# EAGLE design FT232R-Breakout-v36-0805 (EAGLE 6.1)
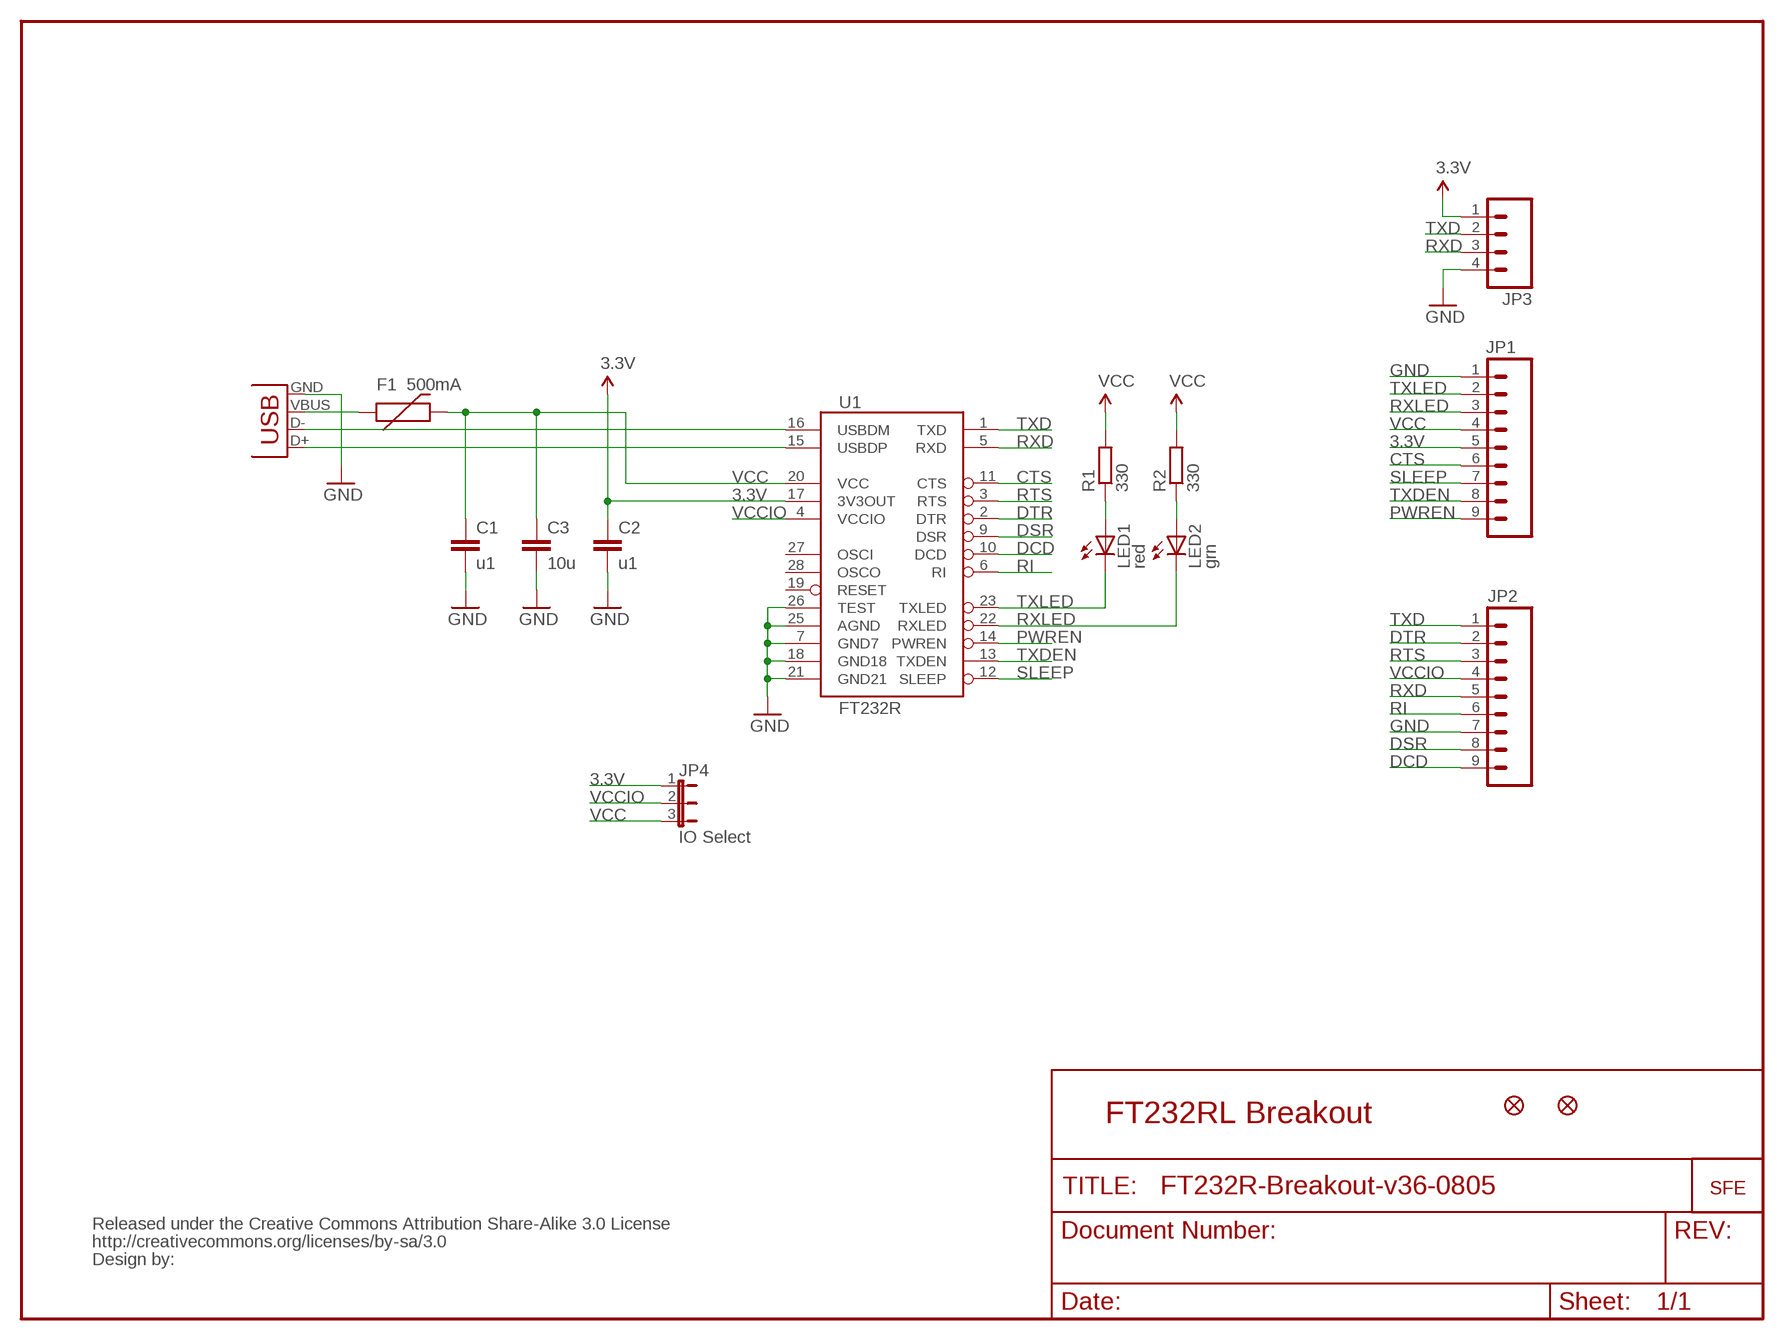
[diagram p0: schematic, sheet 1]

## Parts
C1  u1  C-EUC0805K  [C0805K]
C2  u1  C-EUC0805K  [C0805K]
C3  10u  C-EUC0805K  [C0805K]
F1  500mA  PTC0603  [0603]
JP1  M09  [1X09]
JP2  M09  [1X09]
JP3  M04PTH  [1X04]
JP4  IO Select  JUMPER-3SMD  [SJ_3]
JP5  FIDUCIAL1X2  [FIDUCIAL-1X2]
JP6  FIDUCIAL1X2  [FIDUCIAL-1X2]
LED1  red  LEDCHIP-LED0805  [CHIP-LED0805]
LED2  grn  LEDCHIP-LED0805  [CHIP-LED0805]
R1  330  R-EU_M0805  [M0805]
R2  330  R-EU_M0805  [M0805]
U1  FT232R  FT232RLSSOP  [SSOP28DB]
U$1  CREATIVE_COMMONS  [CREATIVE_COMMONS]
U$2  LOGO-SFENEW  [SFE-NEW-WEBLOGO]
X2  USBSMD  [USB-MINIB]

## Nets
3.3V [power]: C2.1 JP1.5 JP3.1 JP4.1 U1.17(3V3OUT)
CTS: JP1.6 U1.11(CTS)
DCD: JP2.9 U1.10(DCD)
DSR: JP2.8 U1.9(DSR)
DTR: JP2.2 U1.2(DTR)
GND [power]: C1.2 C2.2 C3.2 JP1.1 JP2.7 JP3.4 U1.7(GND7) U1.18(GND18) U1.21(GND21) U1.25(AGND) U1.26(TEST) X2.GND
N$1: LED1.A R1.1
N$2: LED2.A R2.1
N$3: F1.1 X2.VBUS
PWREN: JP1.9 U1.14(PWREN)
RI: JP2.6 U1.6(RI)
RTS: JP2.3 U1.3(RTS)
RXD: JP2.5 JP3.3 U1.5(RXD)
RXLED: JP1.3 LED2.C U1.22(RXLED)
SLEEP: JP1.7 U1.12(SLEEP)
TXD: JP2.1 JP3.2 U1.1(TXD)
TXDEN: JP1.8 U1.13(TXDEN)
TXLED: JP1.2 LED1.C U1.23(TXLED)
USB_D+: U1.15(USBDP) X2.D+
USB_D-: U1.16(USBDM) X2.D-
VCC [power]: C1.1 C3.1 F1.2 JP1.4 JP4.3 R1.2 R2.2 U1.20(VCC)
VCCIO: JP2.4 JP4.2 U1.4(VCCIO)
Unconnected: U1.19(RESET) U1.27(OSCI) U1.28(OSCO)

## Notes on the sheet
- FT232RL Breakout

## Library data of the parts
C1-C3 = rcl:C-EU: CAPACITOR, European symbol
F1 = SparkFun:PTC: Resettable Fuse PTC Resettable Fuse. Spark Fun Electronics SKU : COM-08357
JP1 JP2 = SparkFun:M09: Header 9 Standard 9-pin 0.1" header. Use with straight break away headers (SKU : PRT-00116), right angle break away headers (PRT-00553), swiss pins (PRT-00743), machine pins (PRT-00117), and female headers (PRT-00115).
JP3 = SparkFun:M04: Header 4 Standard 4-pin 0.1" header. Use with straight break away headers (SKU : PRT-00116), right angle break away headers (PRT-00553), swiss pins (PRT-00743), machine pins (PRT-00117), and female headers (PRT-00115). Molex polarized connector foot print use with SKU : PRT-08231 with associated crimp pins and housings.
JP4 = SparkFun:JUMPER-3
JP5 JP6 = SparkFun:FIDUCIAL: Fiducial Alignment Points Various fiducial points for machine vision alignment.
LED1 LED2 = led:LED: LED OSRAM: - CHIPLED LG R971, LG N971, LY N971, LG Q971, LY Q971, LO R971, LY R971 LH N974, LH R974 LS Q976, LO Q976, LY Q976 LO Q996 - Hyper CHIPLED LW Q18S LB Q993, LB Q99A, LB R99A - SideLED LS A670, LO A670, LY A670, LG A670, LP A670 LB A673, LV A673, LT A673, LW A673 LH A674 LY A675 LS A676, LA A676, LO A676, LY A676, LW A676 LS A679, LY A679, LG A679 - Hyper Micro SIDELED® LS Y876, LA Y876, LO Y876, LY Y876 LT Y87S - SmartLED LW L88C, LW L88S LB L89C, LB L89S, LG L890 LS L89K, LO L89K, LY L89K LS L896, LA L896, LO L896, LY L896 - TOPLED LS T670, LO T670, LY T670, LG T670, LP T670 LSG T670, LSP T670, LSY T670, LOP T670, LYG T670 LG T671, LOG T671, LSG T671 LB T673, LV T673, LT T673, LW T673 LH T674 LS T676, LA T676, LO T676, LY T676, LB T676, LH T676, LSB T676, LW T676 LB T67C, LV T67C, LT T67C, LS T67K, LO T67K, LY T67K, LW E67C LS E67B, LA E67B, LO E67B, LY E67B, LB E67C, LV E67C, LT E67C LW T67C LS T679, LY T679, LG T679 LS T770, LO T770, LY T770, LG T770, LP T770 LB T773, LV T773, LT T773, LW T773 LH T774 LS E675, LA E675, LY E675, LS T675 LS T776, LA T776, LO T776, LY T776, LB T776 LHGB T686 LT T68C, LB T68C - Hyper Mini TOPLED® LB M676 - Mini TOPLED Santana® LG M470 LS M47K, LO M47K, LY M47K Source: http://www.osram.convergy.de LUXEON: - LUMILED® LXK2-PW12-R00, LXK2-PW12-S00, LXK2-PW14-U00, LXK2-PW14-V00 LXK2-PM12-R00, LXK2-PM12-S00, LXK2-PM14-U00 LXK2-PE12-Q00, LXK2-PE12-R00, LXK2-PE12-S00, LXK2-PE14-T00, LXK2-PE14-U00 LXK2-PB12-K00, LXK2-PB12-L00, LXK2-PB12-M00, LXK2-PB14-N00, LXK2-PB14-P00, LXK2-PB14-Q00 LXK2-PR12-L00, LXK2-PR12-M00, LXK2-PR14-Q00, LXK2-PR14-R00 LXK2-PD12-Q00, LXK2-PD12-R00, LXK2-PD12-S00 LXK2-PH12-R00, LXK2-PH12-S00 LXK2-PL12-P00, LXK2-PL12-Q00, LXK2-PL12-R00 Source: www.luxeon.com KINGBRIGHT: KA-3528ASYC Source: www.kingbright.com
R1 R2 = rcl:R-EU_: RESISTOR, European symbol
U1 = SparkFun:FT232RL: USB UART FT232RL 4th Generation USB UART (USB <-> Serial) Controller. Spark Fun Electronics SKU : COM-00650
U$1 = SparkFun:CREATIVE_COMMONS
U$2 = SparkFun:LOGO-SFE: Spark Fun Electronics PCB Logo This is the standard Spark Fun Electronics PCB logo.
X2 = SparkFun:USB: USB Connectors USB-B-PTH is fully proven SKU : PRT-00139 USB-miniB is fully proven SKU : PRT-00587 USB-A-PCB is untested. USB-A-H is throughly reviewed, but untested. Spark Fun Electronics SKU : PRT-00437 USB-B-SMT is throughly reviewed, but untested. Needs silkscreen touching up. USB-A-S has not been used/tested USB-MB-H has not been used/tested

## Net classes
0 default: width 0.203 mm
1 power: width 0.254 mm

## Board
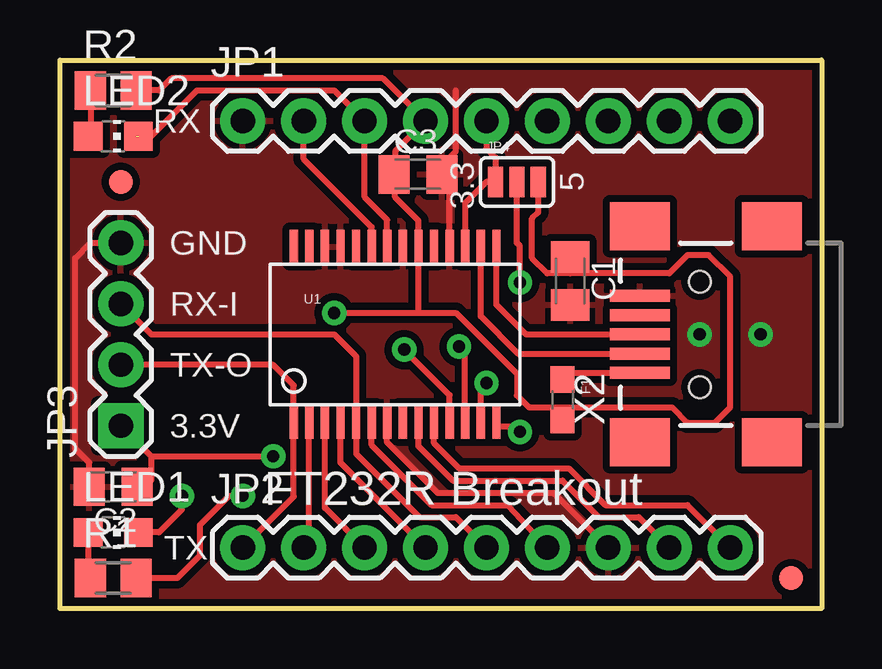
[diagram p1: board, top side]
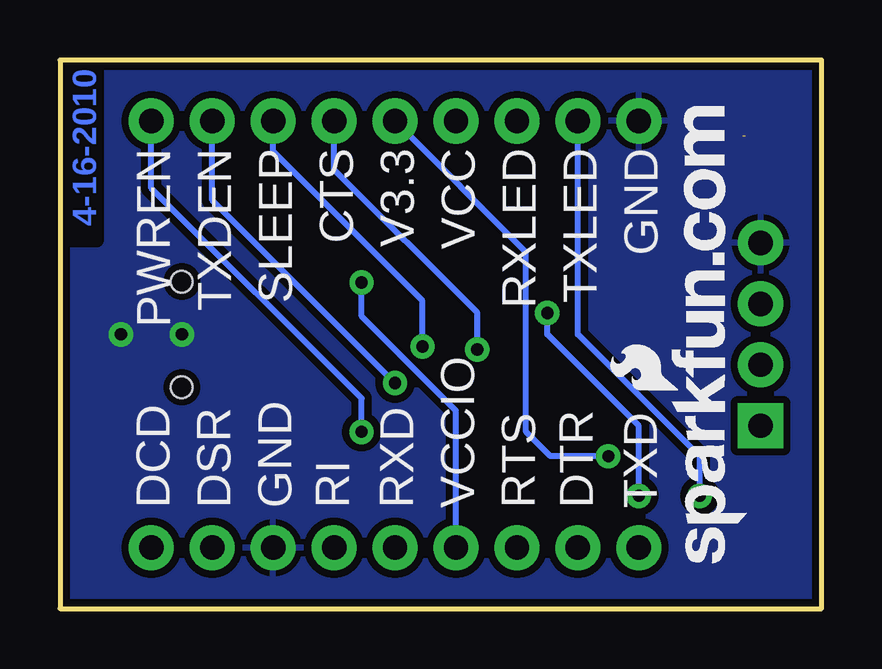
[diagram p2: board, bottom side, seen from below]

Size 31.75 x 22.86 mm. Coordinates in mm from the lower left corner, seen from the top.
Outline: 0,22.86 31.75,22.86 31.75,0 0,0 0,22.86
Copper layers (1*16): Top 0.035mm / dielectric 1.5mm / Bottom 0.035mm
Design rules: minimum track width 8mil, minimum drill 20mil, track to track 8mil, track to pad 8mil, pad to pad 8mil, via to via 8mil, smd to smd 8mil, copper to edge 10mil, drill to drill 8mil, minimum pad ring 12mil, minimum via ring 10mil, stop-mask expansion 4mil, vias tented up to drill 20mil, thermal gap 10mil

### Footprints (pad centres in the part's own frame; a part is rotated, then mirrored left to right if it is on the bottom)
C0805K = smd 1.3 x 1.6: 1 -1,0; 2 1,0
0603 = smd 1.1 x 1: 1 -0.85,0; 2 0.85,0
1X09 = drill 1.016 pad 1.88: 1 0,0; 2 2.54,0; 3 5.08,0; 4 7.62,0; 5 10.16,0; 6 12.7,0; 7 15.24,0; 8 17.78,0; 9 20.32,0
1X04 = drill 1.016 pad 1.88 square: 1 0,0 | drill 1.016 pad 1.88: 2 2.54,0; 3 5.08,0; 4 7.62,0
SJ_3 = smd 0.635 x 1.27: 1 -0.889,0; 2 0,0; 3 0.889,0
FIDUCIAL-1X2 = smd 1 x 1: 1 0,0
CHIP-LED0805 = smd 1.2 x 1.2: A 0,-1.05; C 0,1.05
M0805 = smd 1.3 x 1.6: 1 -0.95,0; 2 0.95,0
SSOP28DB = smd 0.348 x 1.397: 1 -4.225,-3.656; 2 -3.575,-3.656; 3 -2.925,-3.656; 4 -2.275,-3.656; 5 -1.625,-3.656; 6 -0.975,-3.656; 7 -0.325,-3.656; 8 0.325,-3.656; 9 0.975,-3.656; 10 1.625,-3.656; 11 2.275,-3.656; 12 2.925,-3.656; 13 3.575,-3.656; 14 4.225,-3.656; 15 4.225,3.656; 16 3.575,3.656; 17 2.925,3.656; 18 2.275,3.656; 19 1.625,3.656; 20 0.975,3.656; 21 0.325,3.656; 22 -0.325,3.656; 23 -0.975,3.656; 24 -1.625,3.656; 25 -2.275,3.656; 26 -2.925,3.656; 27 -3.575,3.656; 28 -4.225,3.656
USB-MINIB = smd 2.5 x 0.5: D+ 2.5,0; D- 2.5,0.8; GND 2.5,-1.6; ID 2.5,-0.8; VBUS 2.5,1.6 | smd 2.5 x 2: GND@1 -3,-4.5; GND@2 -3,4.5; GND@3 2.5,4.5; GND@4 2.5,-4.5 | hole 0.9: 0,2.2; 0,-2.2

### Placement (x,y rotation side)
C1  21.27,13.65 270 top
C2  2.22,5.08 180 top
C3  14.92,18.1 0 top
F1  20.95,8.7 270 top
JP1  7.62,20.32 0 top
JP2  7.62,2.54 0 top
JP3  2.54,7.62 90 top
JP4  19.05,17.78 0 top
JP5  30.48,1.27 0 top
JP6  2.54,17.78 0 top
LED1  2.22,3.17 270 top
LED2  2.22,19.68 270 top
R1  2.22,1.27 0 top
R2  2.22,21.59 0 top
U1  13.97,11.43 0 top
U$1  20.32,-8.89 0 top  (outside the outline)
U$2  3.11,1.91 90 bottom
X2  26.67,11.43 180 top

### Tracks (layer width: path | path; a pad name or v marks a point on that pad's centre or on a via)
3.3V  (via drill 0.51)
  Top 0.254: 3.81,6.35 v8.89,6.35 | 3.81,6.35 JP3.1 | U1.17 16.89,16.89 17.78,17.78 JP4.1 18.16,18.8 17.78,19.18 JP1.5 | 3.81,6.35 3.81,5.35 C2.1
  Bottom 0.254: v8.89,6.35 11.3,6.35 12.32,7.37 12.32,14.86 JP1.5
CTS  (via drill 0.51)
  Top 0.254: U1.11 16.25,8.9 v14.35,10.79
  Bottom 0.254: JP1.6 20.32,18.29 14.35,12.32 v14.35,10.79
DCD
  Top 0.254: U1.10 15.6,6.88 16.64,5.84 21.21,5.84 22.73,4.32 26.16,4.32 JP2.9
DSR
  Top 0.254: U1.9 14.95,6.77 16.38,5.33 20.95,5.33 22.48,3.81 24.13,3.81 JP2.8
DTR
  Top 0.254: U1.2 10.39,2.77 JP2.2
GND  (via drill 0.51)
  Top 0.254: U1.7 13.64,6.93 15.75,4.83 20.57,4.83 JP2.7 | U1.18 16.25,18.79 16.51,19.05 16.51,21.59 | C2.2 1.22,6.08 0.64,6.67 0.64,14.61 1.27,15.24 JP3.4
  other vias: 26.67,11.43 29.21,11.43
  pour Bottom (isolate 0.305): 0,0 0,22.86 31.75,22.86 31.75,0
  pour Top (isolate 0.305): 0,0 0,22.86 31.75,22.86 31.75,0
N$1
  Top 0.254: LED1.A 1.17,1.37 R1.1
N$2
  Top 0.254: R2.1 1.27,19.79 LED2.A
N$3
  Top 0.254: F1.1 20.95,9.78 21.01,9.83 X2.VBUS
PWREN  (via drill 0.51)
  Top 0.254: U1.14 18.2,7.59 18.96,7.59 v19.18,7.37
  Bottom 0.254: v19.18,7.37 19.18,8.76 27.94,17.53 JP1.9
RI
  Top 0.254: U1.6 12.99,6.82 15.49,4.32 18.67,4.32 JP2.6
RTS
  Top 0.254: U1.3 11.04,4.2 JP2.3
RXD
  Top 0.254: JP2.5 16.51,3.81 14.99,3.81 12.35,6.45 U1.5 12.35,10.52 12.32,10.54 12.19,10.67 11.43,11.43 3.81,11.43 JP3.3
RXLED  (1 unrouted)
  Top 0.254: U1.22 13.64,16.2 12.7,17.14 JP1.3 11.43,21.59 5.71,21.59 3.81,19.68 3.17,19.68
SLEEP  (via drill 0.51)
  Top 0.254: U1.12 16.89,10.66 v16.64,10.92
  Bottom 0.254: JP1.7 22.86,19.05 16.64,12.83 v16.64,10.92
TXD
  Top 0.254: JP2.1 9.74,4.67 U1.1 9.74,9.3 8.89,10.16 JP3.2
TXDEN  (via drill 0.51)
  Top 0.254: U1.13 17.55,9.04 v17.78,9.4
  Bottom 0.254: v17.78,9.4 25.4,17.02 JP1.8
TXLED  (via drill 0.51)
  Top 0.254: v5.08,4.7 5.08,4.13 4.13,3.17 LED1.C 3.17,3.17 | U1.23 12.99,15.9 10.16,18.73 JP1.2
  Bottom 0.254: JP1.2 10.16,11.43 5.08,6.35 v5.08,4.7
USB_D+
  Top 0.254: X2.D+ 19.43,11.43 18.2,12.67 U1.15
USB_D-
  Top 0.254: U1.16 17.55,12.17 19.09,10.63 X2.D-
VCC  (via drill 0.51)
  Top 0.254: 20.95,7.62 F1.2 20.95,8.38 | v11.43,12.32 14.99,12.32 | 14.99,12.32 16.51,12.32 19.05,9.78 19.05,8.89 19.56,8.38 20.95,8.38 | v7.62,4.7 7.05,4.7 5.84,3.49 5.84,2.22 4.89,1.27 R1.2 | 14.99,12.32 14.95,12.36 U1.20 14.95,16.17 13.97,17.14 13.97,18.14 | JP4.3 19.94,16.51 19.68,16.26 19.68,14.61 20.32,13.97 21.27,13.97 | 21.27,13.97 25.4,13.97 26.16,14.73 27.05,14.73 27.94,13.84 27.94,8.38 27.3,7.75 26.16,7.75 25.53,8.38 20.95,8.38 | 13.97,18.14 13.97,19.05 JP1.4 13.46,22.1 4.64,22.1 4.13,21.59 R2.2 | 13.97,18.14 C3.1 | C1.1 21.27,13.97
  Bottom 0.254: v11.43,12.32 11.43,11.43 7.62,7.62 v7.62,4.7
VCCIO  (via drill 0.51)
  Top 0.254: U1.4 11.7,6.08 JP2.4 | v19.18,13.59 19.18,15.11 19.05,15.24 JP4.2
  Bottom 0.254: JP2.4 15.24,8.26 19.18,12.19 v19.18,13.59

### Text on the board
Bottom: 4-16-2010
tPlace: RX | 3.3 | 5 | GND | RX-I | TX-O | 3.3V | FT232R Breakout | TX
bPlace: GND | TXLED | RXLED | VCC | V3.3 | CTS | SLEEP | TXDEN | PWREN | TXD | DTR | RTS | VCCIO | RXD | RI | GND | DSR | DCD